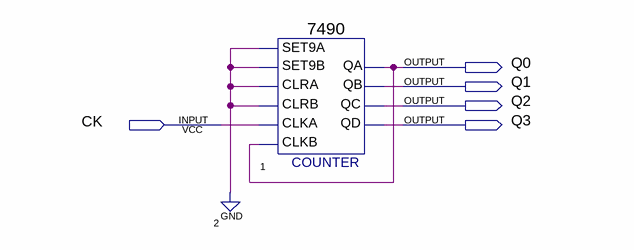
[diagram p0: schematic sheet]
// Quartus schematic 10_MOD_7490.bdf as structural Verilog: 1 symbols, 5 pins
module \10_MOD_7490  (
  input  CK,
  output Q0,
  output Q1,
  output Q2,
  output Q3
);

  \7490  u_1 (
    .SET9A(1'b0), .CLRA(1'b0), .SET9B(1'b0), .CLKB(Q0), .CLKA(CK), .CLRB(1'b0), .QD(Q3), .QC(Q2), .QB(Q1),
    .QA(Q0));
endmodule
